# EAGLE design LCD Daughterboard v1.0 (EAGLE 7.7.0)
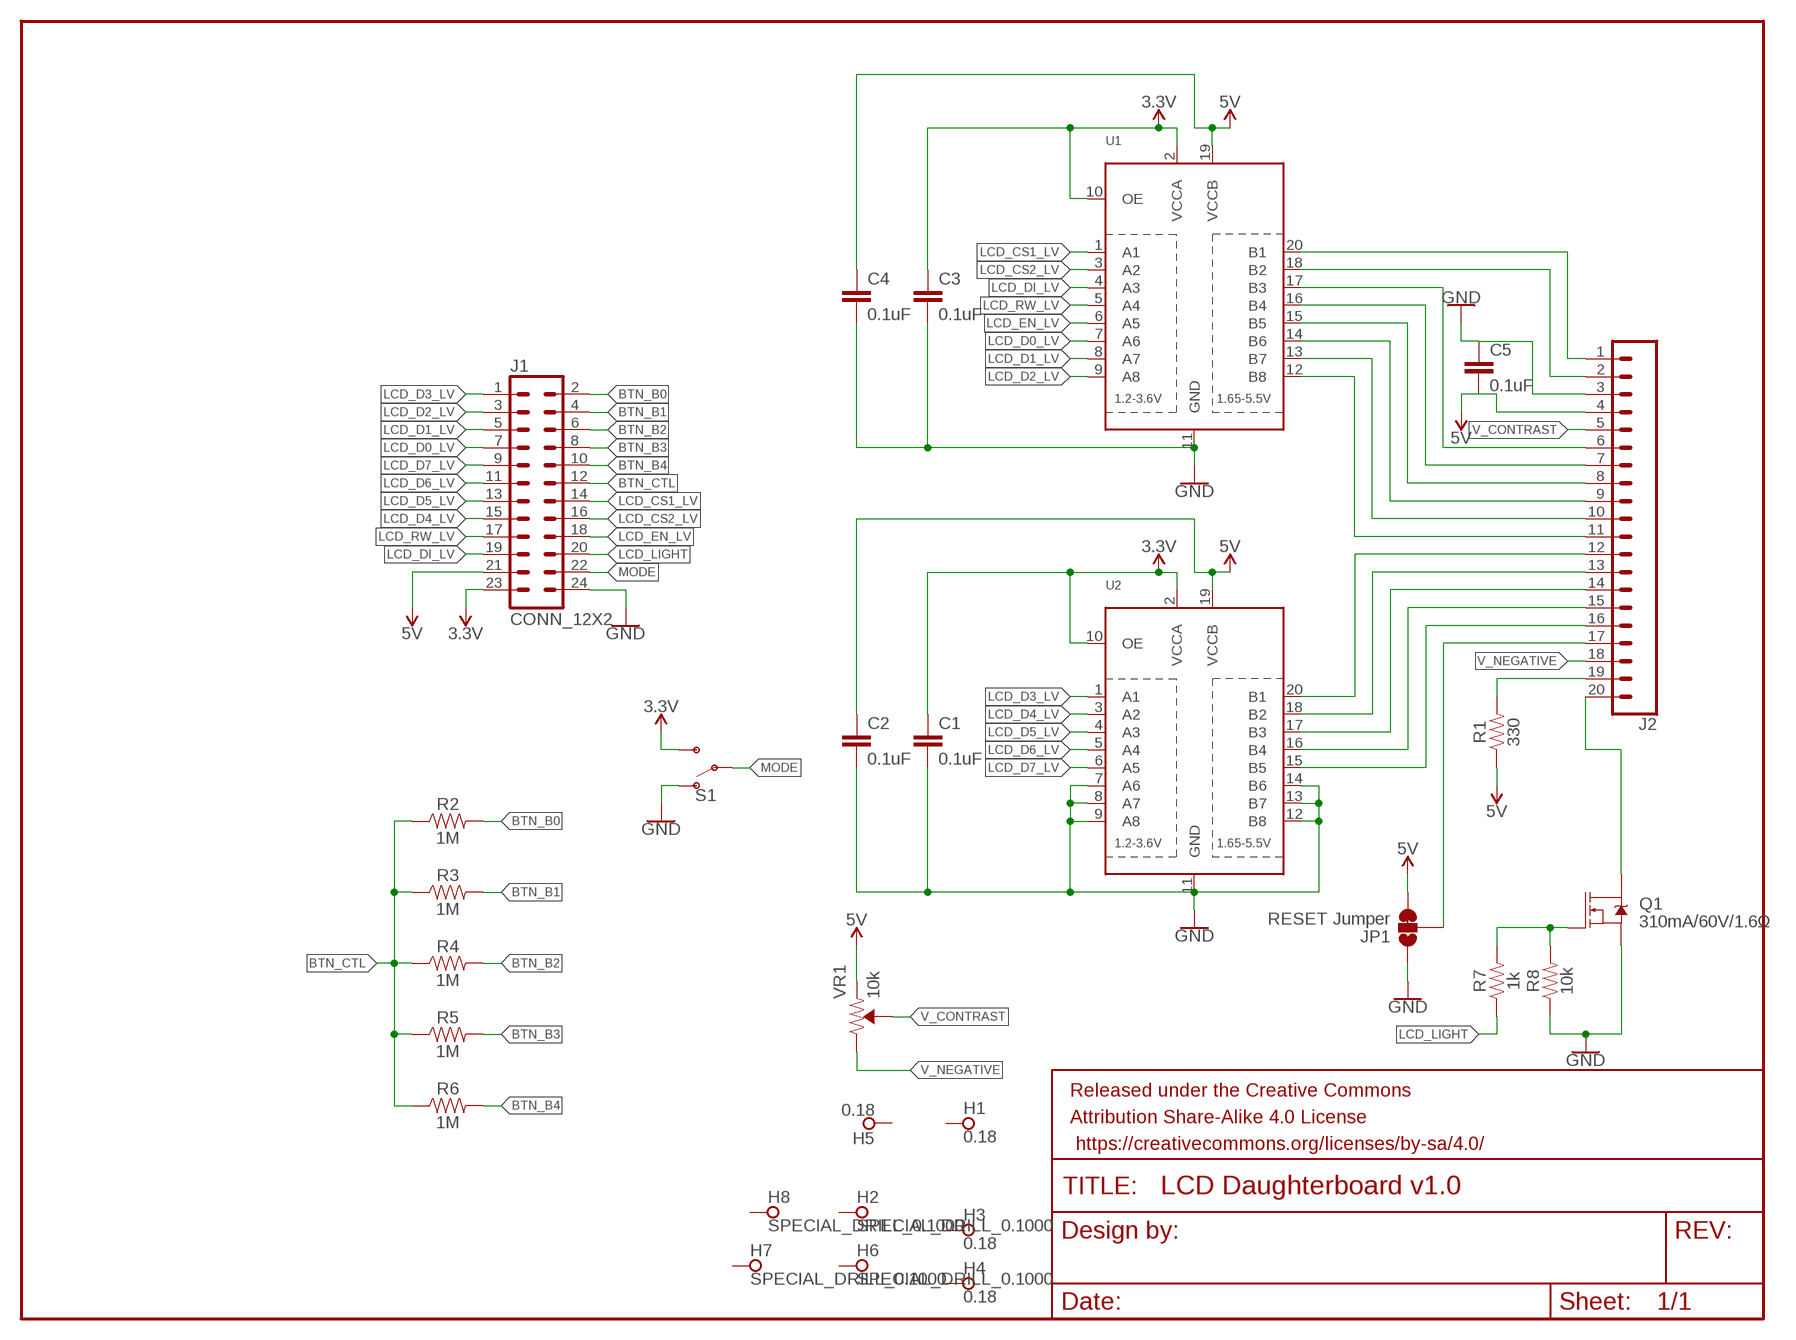
[diagram p0: schematic, sheet 1]

## Parts
C1  0.1uF  0.1UF-0603-25V-(+80/-20%)  [0603]
C2  0.1uF  0.1UF-0603-25V-(+80/-20%)  [0603]
C3  0.1uF  0.1UF-0603-25V-(+80/-20%)  [0603]
C4  0.1uF  0.1UF-0603-25V-(+80/-20%)  [0603]
C5  0.1uF  0.1UF-0603-25V-(+80/-20%)  [0603]
FRAME1  FRAME-LETTERNO_PACKAGE  [DUMMY]
H1  0.18  SPECIAL_DRILL_0.1800  [PAD_0.1800]
H2  SPECIAL_DRILL_0.1000  [PAD_0.1000]
H3  0.18  SPECIAL_DRILL_0.1800  [PAD_0.1800]
H4  0.18  SPECIAL_DRILL_0.1800  [PAD_0.1800]
H5  0.18  SPECIAL_DRILL_0.1800  [PAD_0.1800]
H6  SPECIAL_DRILL_0.1000  [PAD_0.1000]
H7  SPECIAL_DRILL_0.1000  [PAD_0.1000]
H8  SPECIAL_DRILL_0.1000  [PAD_0.1000]
J1  CONN_12X2  [2X12]
J2  CONN_20LOCK  [1X20_LOCK]
JP1  RESET Jumper  JUMPER-SMT_3_1-NC_TRACE_SILK  [SMT-JUMPER_3_1-NC_TRACE_SILK]
Q1  310mA/60V/1.6Ω  MOSFET-NCH-2N7002PW  [SOT323]
R1  330  330OHM-0603-1/10W-1%  [0603]
R2  1M  1MOHM-0603-1/4W-5%  [0603]
R3  1M  1MOHM-0603-1/4W-5%  [0603]
R4  1M  1MOHM-0603-1/4W-5%  [0603]
R5  1M  1MOHM-0603-1/4W-5%  [0603]
R6  1M  1MOHM-0603-1/4W-5%  [0603]
R7  1k  1KOHM-0603-1/10W-1%  [0603]
R8  10k  10KOHM-0603-1/10W-1%  [0603]
S1  SWITCH-SPDT-PTH-11.6X4.0MM  [SWITCH_SPDT_PTH_11.6X4.0MM]
U1  TXB0108PWR  [TSSOP20]
U2  TXB0108PWR  [TSSOP20]
VR1  10k  TRIMPOT-PTH-10MM-KNOB-1/2W-10%  [TRIMPOT-PTH-3386U]

## Nets
3.3V: C1.1 C3.1 J1.23 S1.3(S) U1.2(VCCA) U1.10(OE) U2.2(VCCA) U2.10(OE)
5V: C2.1 C4.1 C5.2 J1.21 J2.4 JP1.3 R1.1 U1.19(VCCB) U2.19(VCCB) VR1.1(CCW)
BTN_B0: J1.2 R2.2
BTN_B1: J1.4 R3.2
BTN_B2: J1.6 R4.2
BTN_B3: J1.8 R5.2
BTN_B4: J1.10 R6.2
BTN_CTL: J1.12 R2.1 R3.1 R4.1 R5.1 R6.1
GND: C1.2 C2.2 C3.2 C4.2 C5.1 J1.24 J2.3 JP1.1 Q1.2(S) R8.1 S1.1(O) U1.11(GND) U2.7(A6) U2.8(A7) U2.9(A8) U2.11(GND) U2.12(B8) U2.13(B7) U2.14(B6)
LCD_CS1_LV: J1.14 U1.1(A1)
LCD_CS2_LV: J1.16 U1.3(A2)
LCD_D0_LV: J1.7 U1.7(A6)
LCD_D1_LV: J1.5 U1.8(A7)
LCD_D2_LV: J1.3 U1.9(A8)
LCD_D3_LV: J1.1 U2.1(A1)
LCD_D4_LV: J1.15 U2.3(A2)
LCD_D5_LV: J1.13 U2.4(A3)
LCD_D6_LV: J1.11 U2.5(A4)
LCD_D7_LV: J1.9 U2.6(A5)
LCD_DI_LV: J1.19 U1.4(A3)
LCD_EN_LV: J1.18 U1.6(A5)
LCD_LIGHT: J1.20 R7.1
LCD_RW_LV: J1.17 U1.5(A4)
MODE: J1.22 S1.2(P)
N$1: J2.1 U1.20(B1)
N$2: J2.2 U1.18(B2)
N$3: J2.6 U1.17(B3)
N$4: J2.7 U1.16(B4)
N$5: J2.8 U1.15(B5)
N$6: J2.9 U1.14(B6)
N$7: J2.10 U1.13(B7)
N$8: J2.11 U1.12(B8)
N$9: J2.19 R1.2
N$10: J2.20 Q1.3(D)
N$11: J2.12 U2.20(B1)
N$12: J2.13 U2.18(B2)
N$13: J2.14 U2.17(B3)
N$14: J2.15 U2.16(B4)
N$15: J2.16 U2.15(B5)
N$16: J2.17 JP1.2
N$17: Q1.1(G) R7.2 R8.2
V_CONTRAST: J2.5 VR1.2(WIPER)
V_NEGATIVE: J2.18 VR1.3(CW)
Unconnected: H1.1 H2.1 H3.1 H4.1 H5.1 H6.1 H7.1 H8.1

## Library data of the parts
C1-C5 = SparkFun-Capacitors:0.1UF: 0.1µF ceramic capacitors A capacitor is a passive two-terminal electrical component used to store electrical energy temporarily in an electric field.; PROD_ID: CAP-00810
FRAME1 = SparkFun-Aesthetics:FRAME-LETTER: Schematic Frame - Letter Standard 8.5x11 US Letter frame; DESIGNER: Nobody; VERSION: v01
H1-H8 = special-drill:SPECIAL_DRILL_: Special drills
J1 = SparkFun-Connectors:CONN_12X2: Multi connection point. Often used as Generic Header-pin footprint for 0.1 inch spaced/style header connections On any of the 0.1 inch spaced packages, you can populate with these: Break Away Headers - Straight <https://www.sparkfun.com/products/116> (PRT-00116) Break Away Male Headers - Right Angle <https://www.sparkfun.com/products/553> (PRT-00553) Female Headers <https://www.sparkfun.com/products/115> (PRT-00115) Break Away Headers - Machine Pin <https://www.sparkfun.com/products/117> (PRT-00117) Break Away Female Headers - Swiss Machine Pin <https://www.sparkfun.com/products/743> (PRT-00743)
J2 = SparkFun-Connectors:CONN_20: Multi connection point. Often used as Generic Header-pin footprint for 0.1 inch spaced/style header connections On any of the 0.1 inch spaced packages, you can populate with these: Break Away Headers - Straight <https://www.sparkfun.com/products/116> (PRT-00116) Break Away Male Headers - Right Angle <https://www.sparkfun.com/products/553> (PRT-00553) Female Headers <https://www.sparkfun.com/products/115> (PRT-00115) Break Away Headers - Machine Pin <https://www.sparkfun.com/products/117> (PRT-00117) Break Away Female Headers - Swiss Machine Pin <https://www.sparkfun.com/products/743> (PRT-00743) For SCREWTERMINALS and SPRING TERMINALS visit here: Screw Terimnals on SparkFun.com <https://www.sparkfun.com/search/results?term=Screw+Terminals> (5mm/3.5mm/2.54mm spacing) This device is also useful as a general connection point to wire up your design to another part of your project. Our various solder wires solder well into these plated through hole pads. Hook-Up Wire - Assortment (Stranded, 22 AWG) <https://www.sparkfun.com/products/11375> (PRT-11375) Hook-Up Wire - Assortment (Solid Core, 22 AWG) <https://www.sparkfun.com/products/11367> (PRT-11367) View the entire wire category on our website here <https://www.sparkfun.com/categories/141> Special notes: Molex polarized connector foot print use with SKU : PRT-08231 with associated crimp pins and housings. 1MM SMD Version SKU: PRT-10208 NOTES ON THE VARIANTS LOCK and LOCK_LONGPADS... This footprint was designed to help hold the alignment of a through-hole component (i.e. 6-pin header) while soldering it into place. You may notice that each hole has been shifted either up or down by 0.005 of an inch from it's more standard position (which is a perfectly straight line). This slight alteration caused the pins (the squares in the middle) to touch the edges of the holes. Because they are alternating, it causes a "brace" to hold the component in place. 0.005 has proven to be the perfect amount of "off-center" position when using our standard breakaway headers. Although looks a little odd when you look at the bare footprint, once you have a header in there, the alteration is very hard to notice. Also,if you push a header all the way into place, it is covered up entirely on the bottom side. Note about LOCK SPECIAL package: This is just like the LOCK variant in that the holes are staggared by 5 mil, but except for the last two holes. They are not altered from the "standard" footprint layout. This is used for a special purpose on the layout of our Graphic LCD Backpack. Make sure you want to use this device before selecting it for you project!
JP1 = SparkFun-Jumpers:JUMPER-SMT_3_1-NC_TRACE: Normally closed trace jumper (1 of 2 connections) This jumper has a trace between two pads so it's normally closed (NC). The other connection is normally open (NO). Use a razor knife to open the connection. For best results follow the IPC guidelines for cutting traces: Cutout at least 0.063 mm (0.005 in). Remove all loose material to clean up the cut area. Seal the cut with an approved epoxy. Reapply solder to reclose the connection, or to close the NO connection.
Q1 = SparkFun-DiscreteSemi:MOSFET-NCH: N-channel MOSFETs Voltage controlled devices that allow control of high current outputs. SparkFun Products: SparkFun OpenScale <https://www.sparkfun.com/products/13261> SparkFun Digital Sandbox <https://www.sparkfun.com/products/12651> SparkFun Monster Moto Shield <https://www.sparkfun.com/products/10182> SparkFun MOSFET Power Controller <https://www.sparkfun.com/products/11214>; PROD_ID: TRANS-11151
R1 = SparkFun-Resistors:330OHM: 330Ω resistor A resistor is a passive two-terminal electrical component that implements electrical resistance as a circuit element. Resistors act to reduce current flow, and, at the same time, act to lower voltage levels within circuits. - Wikipedia; PROD_ID: RES-00818
R2-R6 = SparkFun-Resistors:1MOHM: 1MΩ resistor A resistor is a passive two-terminal electrical component that implements electrical resistance as a circuit element. Resistors act to reduce current flow, and, at the same time, act to lower voltage levels within circuits. - Wikipedia; PROD_ID: RES-07868
R7 = SparkFun-Resistors:1KOHM: 1kΩ resistor A resistor is a passive two-terminal electrical component that implements electrical resistance as a circuit element. Resistors act to reduce current flow, and, at the same time, act to lower voltage levels within circuits. - Wikipedia; PROD_ID: RES-07856
R8 = SparkFun-Resistors:10KOHM: 10kΩ resistor A resistor is a passive two-terminal electrical component that implements electrical resistance as a circuit element. Resistors act to reduce current flow, and, at the same time, act to lower voltage levels within circuits. - Wikipedia; PROD_ID: RES-00824
S1 = SparkFun-Switches:SWITCH-SPDT: Single Pole, Double Throw (SPDT) Switch Single-pole, double-throw (SPDT) switch. Variant Overview SMD-AYZ0202 Surface Mount DPDT Switch <https://www.sparkfun.com/products/597> (COM-00597) Used on e.g. LilyPad Arduino USB - ATmega32U4 Board <https://www.sparkfun.com/products/12049> PTH-11.6X4.0MM SPDT Mini Power Switch <https://www.sparkfun.com/products/102> (COM-00102) Used on e.g. SparkFun Simon Says - Through-Hole Soldering Kit <https://www.sparkfun.com/products/10547> (KIT-10547) PTH-11.6X4.0MM-KIT KIT version of SPDT Mini Power Switch - Simplifies soldering by removing tStop of switch pins - only one side can be soldered. PTH-11.6X4.0MM-LOCK LOCK version of SPDT Mini Power Switch - Offset pins hold switch in place for easier soldering. SMD-RIGHT-ANGLE Surface Mount Right Angle Switch <https://www.sparkfun.com/products/10860> (COM-10860) Used on e.g. SparkFun ESP8266 Thing <https://www.sparkfun.com/products/13231>; PROD_ID: SWCH-08261; SF_SKU: COM-00102
U1 U2 = adafruit:TXB0108PWR: 8-Bit Bi-Directional Level Shifter 1.2V-3.6V (VCCA) to 1.65V-5.5V (VCCB) bi-directional level shifter with auto direction sensing. Max data rate - VCCA 1.8V: 20Mbps (50ns), VCCA 3.3V: 100Mbps (10ns) Digikey: 296-21527-1-ND
VR1 = SparkFun-Resistors:TRIMPOT: Trimming Potentiometer (Trimpot) Three-terminal potentiometers, with an adjustable wiper and two adjustable resistors. A pot can be used to create a configurable voltage divider, or as a variable resistor. "Trimpots" are a subset of potentiometers, usually intended for "set-and-forget" applications. They're often more delicate than standard potentiometers - rated for fewer turns. Variants PTH-KNOB - PTH Trimpot w/ finger-adjustable knob Trimpot 10K with Knob <https://www.sparkfun.com/products/9806> (COM-09806) Datasheet <http://www.sparkfun.com/datasheets/Components/General/TSR-3386.pdf> SMD-3MM-CLOSED-FRAME - SMD 3mm Square Closed-Frame Trimpot Used on e.g. EasyDriver - Stepper Motor Driver <https://www.sparkfun.com/products/12779> Datasheet <http://www.bitechnologies.com/pdfs/22.pdf> (22AR10KTR) SMD-5MM - SMD 5mm Square Closed-Frame Trimpot Used on e.g. IOIO-OTG - V2.2 <https://www.sparkfun.com/products/13613> Datasheet <http://www.vishay.com/docs/51008/ts53.pdf> (TS53YL502MR10) SMD-3MM-1/10W-25% - 3mm Square Open-Frame Trimpot Used on e.g. SparkFun Shapeoko <https://www.sparkfun.com/products/13899> Datasheet <http://www.bourns.com/docs/Product-Datasheets/TC33.pdf> (TC33X-2-103E); PROD_ID: RES-09730; SF_SKU: COM-09806

## Board
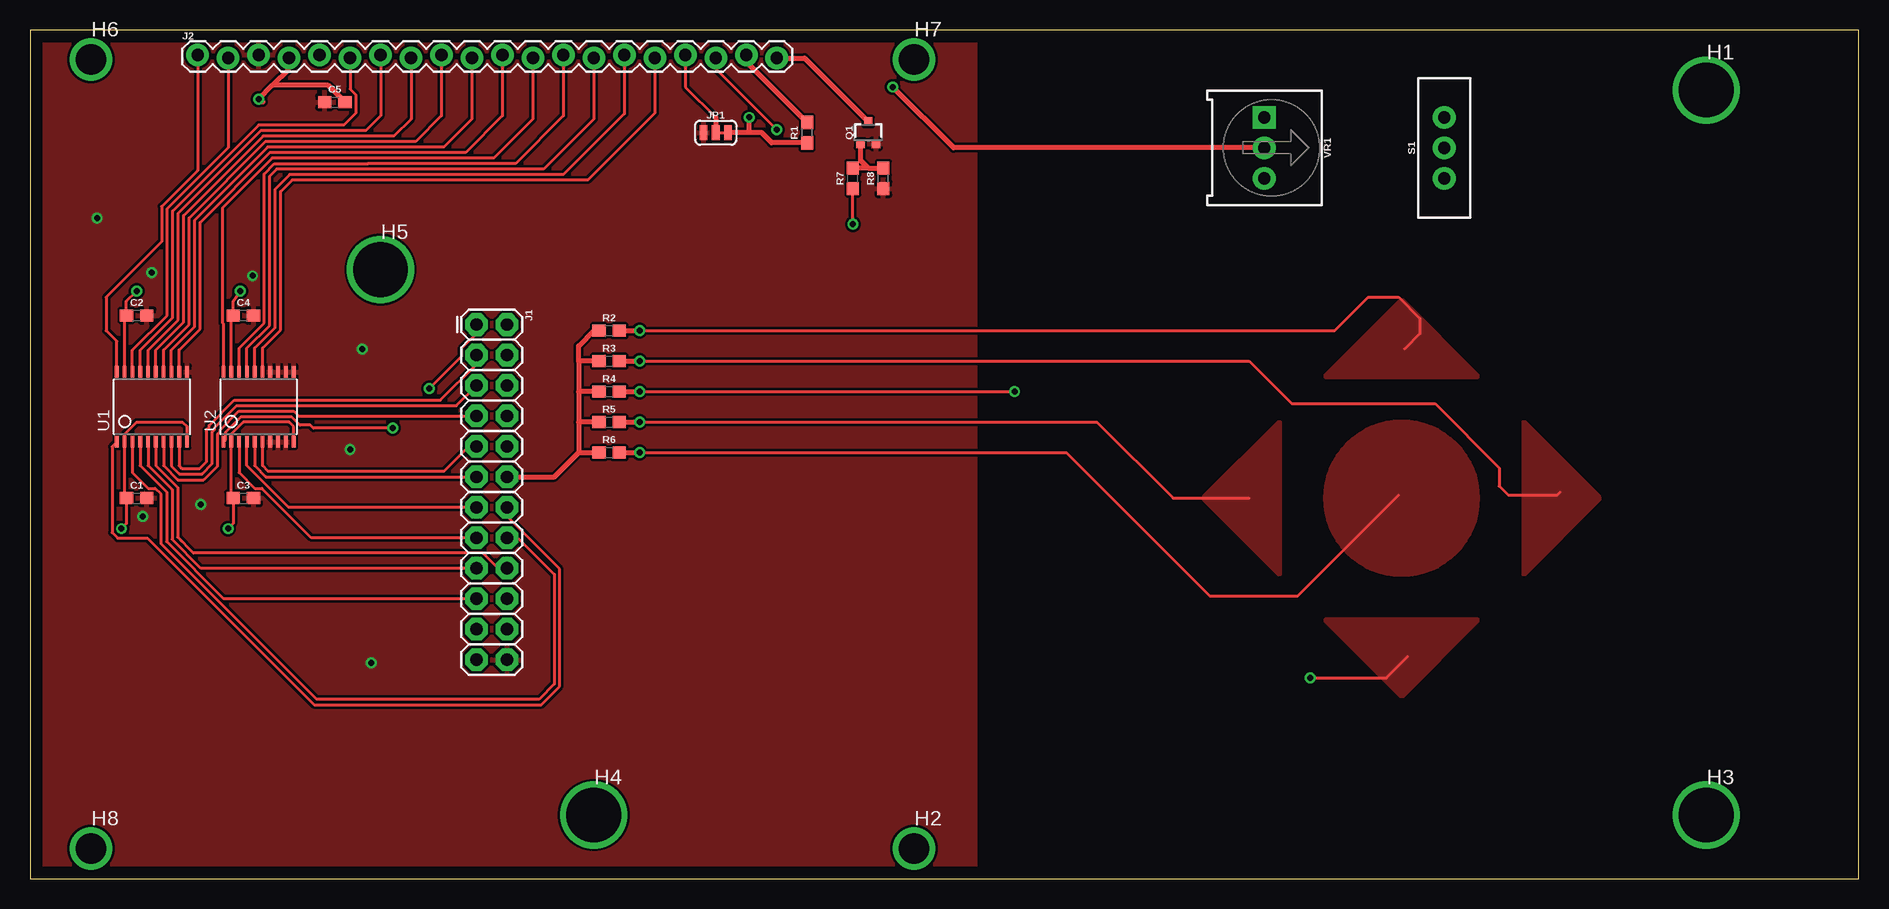
[diagram p1: board, top side]
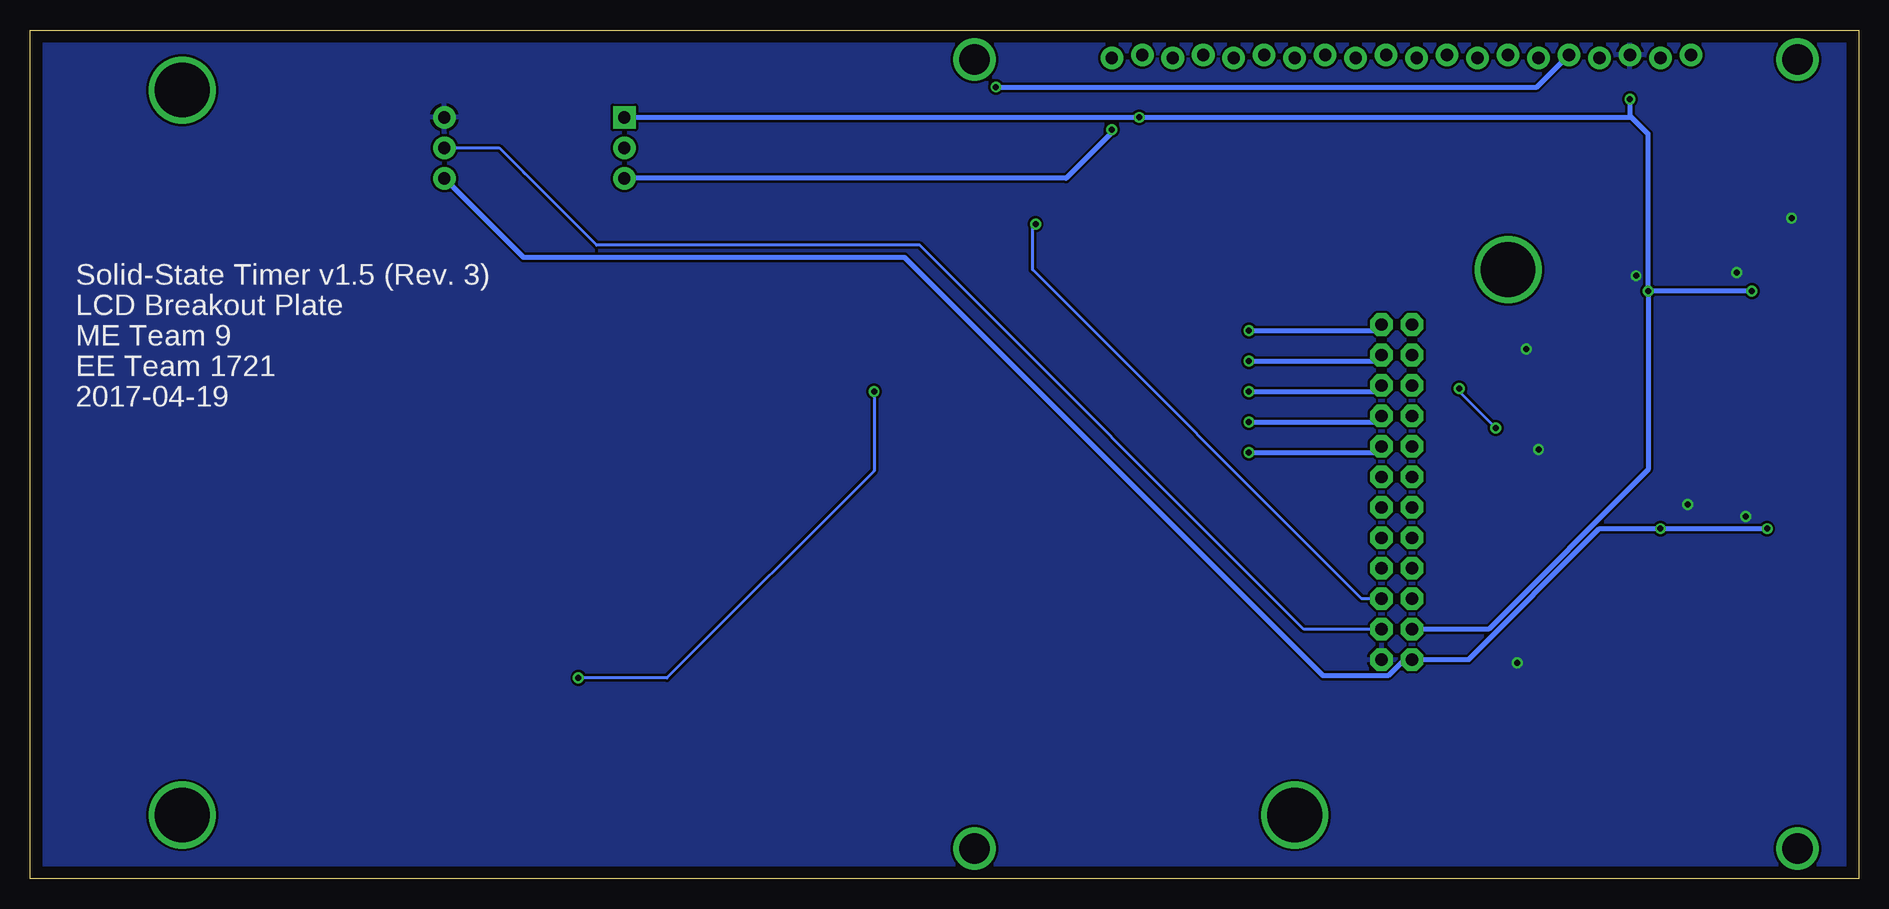
[diagram p2: board, bottom side, seen from below]

Size 152.38 x 70.79 mm. Coordinates in mm from the lower left corner, seen from the top.
Outline: 0,0 152.38,0 152.38,70.79 0,70.79 0,0
Copper layers (1*16): Top 0.035mm / dielectric 1.5mm / Bottom 0.035mm
Design rules "default *": minimum track width 10mil, minimum drill 19mil, track to track 8mil, track to pad 8mil, pad to pad 8mil, via to via 8mil, smd to smd 8mil, copper to edge 40mil, drill to drill 8mil, minimum pad ring 10mil, minimum via ring 8mil, stop-mask expansion 4mil, vias tented up to drill 0mil, thermal gap 10mil

### Footprints (pad centres in the part's own frame; a part is rotated, then mirrored left to right if it is on the bottom)
0603 = smd 1.1 x 1: 1 -0.85,0; 2 0.85,0
PAD_0.1800 = drill 4.572 pad 4.572: 1 0,0
PAD_0.1000 = drill 2.54 pad 2.54: 1 0,0
2X12 = drill 1.016 pad 1.88 octagon: 1 0,0; 2 0,2.54; 3 2.54,0; 4 2.54,2.54; 5 5.08,0; 6 5.08,2.54; 7 7.62,0; 8 7.62,2.54; 9 10.16,0; 10 10.16,2.54; 11 12.7,0; 12 12.7,2.54; 13 15.24,0; 14 15.24,2.54; 15 17.78,0; 16 17.78,2.54; 17 20.32,0; 18 20.32,2.54; 19 22.86,0; 20 22.86,2.54; 21 25.4,0; 22 25.4,2.54; 23 27.94,0; 24 27.94,2.54
1X20_LOCK = drill 1.016 pad 1.88: 1 0,0.127; 2 2.54,-0.127; 3 5.08,0.127; 4 7.62,-0.127; 5 10.16,0.127; 6 12.7,-0.127; 7 15.24,0.127; 8 17.78,-0.127; 9 20.32,0.127; 10 22.86,-0.127; 11 25.4,0.127; 12 27.94,-0.127; 13 30.48,0.127; 14 33.02,-0.127; 15 35.56,0.127; 16 38.1,-0.127; 17 40.64,0.127; 18 43.18,-0.127; 19 45.72,0.127; 20 48.26,-0.127
SMT-JUMPER_3_1-NC_TRACE_SILK = smd 0.635 x 1.27: 1 -1.016,0; 2 0,0; 3 1.016,0
SOT323 = smd 0.7 x 0.7: 1 -0.65,-0.925; 2 0.65,-0.925; 3 0,0.925
SWITCH_SPDT_PTH_11.6X4.0MM = drill 1.016 pad 1.88: 1 0,2.54; 2 0,0; 3 0,-2.54
TSSOP20 = smd 0.305 x 0.991: 1 -2.925,-2.918; 2 -2.275,-2.918; 3 -1.625,-2.918; 4 -0.975,-2.918; 5 -0.325,-2.918; 6 0.325,-2.918; 7 0.975,-2.918; 8 1.625,-2.918; 9 2.275,-2.918; 10 2.925,-2.918; 11 2.925,2.918; 12 2.275,2.918; 13 1.625,2.918; 14 0.975,2.918; 15 0.325,2.918; 16 -0.325,2.918; 17 -0.975,2.918; 18 -1.625,2.918; 19 -2.275,2.918; 20 -2.925,2.918
TRIMPOT-PTH-3386U = drill 1.016 pad 1.88 square: 1 -2.54,-0.015 | drill 1.016 pad 1.88: 2 0,-0.015; 3 2.54,-0.015

### Placement (x,y rotation side)
C1  8.89,31.75 0 top
C2  8.89,46.99 0 top
C3  17.78,31.75 0 top
C4  17.78,46.99 0 top
C5  25.4,64.77 0 top
FRAME1  0,-59.69 0 top  (outside the outline)
H1  139.7,65.79 0 top
H2  73.66,2.54 0 top
H3  139.7,5.33 0 top
H4  46.99,5.33 0 top
H5  29.21,50.8 0 top
H6  5.08,68.33 0 top
H7  73.66,68.33 0 top
H8  5.08,2.54 0 top
J1  37.21,46.23 270 top
J2  13.97,68.58 0 top
JP1  57.15,62.23 0 top
Q1  69.85,62.23 0 top
R1  64.77,62.23 90 top
R2  48.26,45.72 0 top
R3  48.26,43.18 0 top
R4  48.26,40.64 0 top
R5  48.26,38.1 0 top
R6  48.26,35.56 0 top
R7  68.58,58.42 90 top
R8  71.12,58.42 90 top
S1  117.86,60.96 0 top
U1  10.16,39.37 0 top
U2  19.05,39.37 0 top
VR1  102.87,60.96 270 top

### Tracks (layer width: path | path; a pad name or v marks a point on that pad's centre or on a via)
3.3V  (via drill 0.5)
  Top 0.254: U2.10 21.98,37.72 21.59,38.1 17.78,38.1 16.77,37.09 U2.2 16.77,31.91 C3.1 16.93,29.63 v16.51,29.21 | U1.10 13.09,37.72 12.7,38.1 8.89,38.1 7.88,37.09 U1.2 7.88,31.91 C1.1 8.04,29.63 v7.62,29.21
  Bottom 0.406: v7.62,29.21 v16.51,29.21 21.59,29.21 32.51,18.29 J1.23 37.85,18.29 39.19,16.94 44.63,16.94 79.5,51.82 111.25,51.82 S1.3
5V  (via drill 0.5)
  Top 0.254: U2.19 16.77,46.84 C4.1 16.93,48.17 v17.53,49.02 | U1.19 7.88,46.84 C2.1 8.04,48.17 v8.89,49.02
  Top 0.406: 59.94,62.23 60.96,62.23 61.81,61.38 R1.1 | 59.94,62.23 JP1.3 | 59.94,62.23 v59.94,63.5 | 19.41,64.77 arc-45 19.23,64.84 v19.05,65.02 20.19,66.17 | 20.19,66.17 21.59,67.56 J2.4 | C5.2 24.85,66.17 20.19,66.17
  Bottom 0.406: v8.89,49.02 v17.53,49.02 | J1.21 30.83,20.83 17.53,34.14 v17.53,49.02 | VR1.1 v59.94,63.5 18.92,63.5 | v17.53,49.02 17.53,62.1 18.61,63.18 18.92,63.5 | v19.05,65.02 19.05,63.63 18.92,63.5
BTN_B0  (via drill 0.5)
  Top 0.254: v50.8,45.72 108.71,45.72 111.51,48.51 114.05,48.51 115.82,46.74 115.82,45.47 114.55,44.2
  Top 0.406: R2.2 v50.8,45.72
  Bottom 0.406: v50.8,45.72 40.26,45.72 J1.2
  pour Top: 107.95,41.91 120.65,41.91 114.3,48.26
BTN_B1  (via drill 0.5)
  Top 0.254: v50.8,43.18 101.6,43.18 105.16,39.62 117.09,39.62 122.43,34.29 122.43,32.77 123.19,32 127.25,32 127.51,32.26
  Top 0.406: R3.2 v50.8,43.18
  Bottom 0.406: v50.8,43.18 40.26,43.18 J1.4
  pour Top: 124.46,38.1 124.46,25.4 130.81,31.75
BTN_B2  (via drill 0.5)
  Top 0.254: v50.8,40.64 v82.04,40.64 | v106.68,16.76 113.03,16.76 114.81,18.54
  Top 0.406: R4.2 v50.8,40.64
  Bottom 0.254: v82.04,40.64 82.04,34.04 99.31,16.76 v106.68,16.76
  Bottom 0.406: v50.8,40.64 40.26,40.64 J1.6
  pour Top: 120.65,21.59 107.95,21.59 114.3,15.24
BTN_B3  (via drill 0.5)
  Top 0.254: v50.8,38.1 88.9,38.1 95.25,31.75 101.6,31.75
  Top 0.406: R5.2 v50.8,38.1
  Bottom 0.406: v50.8,38.1 40.26,38.1 J1.8
  pour Top: 104.14,25.4 104.14,38.1 97.79,31.75
BTN_B4  (via drill 0.5)
  Top 0.254: v50.8,35.56 86.36,35.56 98.3,23.62 105.66,23.62 114.05,32
  Top 0.406: R6.2 v50.8,35.56
  Bottom 0.406: v50.8,35.56 40.26,35.56 J1.10
  pour Top: 114.3,25.4 arc180 114.3,38.1 arc180
BTN_CTL
  Top 0.406: 45.72,35.56 R6.1 | R2.1 46.99,45.72 45.72,44.45 45.72,43.18 | 45.72,40.64 45.72,38.1 | 45.72,43.18 45.72,40.64 | 45.72,38.1 45.72,35.56 | R5.1 45.72,38.1 | R4.1 45.72,40.64 | R3.1 45.72,43.18 | J1.12 43.69,33.53 45.72,35.56
GND  (via drill 0.5)
  other vias: 28.45,18.03 27.69,44.2 5.59,55.12 10.16,50.55 18.54,50.29 9.4,30.23 14.22,31.24 26.67,35.81
  pour Bottom: 0,70.87 152.4,70.87 152.4,0 0,0
  pour Top: 0,70.87 78.74,70.87 78.74,0 0,0
LCD_CS1_LV
  Top 0.254: U1.1 6.84,36.05 6.84,28.89 7.29,28.43 9.79,28.43 23.69,14.53 42.61,14.53 44.15,16.07 44.15,25.85 39.75,30.24 J1.14
LCD_CS2_LV
  Top 0.254: J1.16 40.64,28.45 43.69,25.4 43.69,16.26 42.42,14.99 23.88,14.99 10.92,27.94 10.92,32.09 10.43,32.58 9.84,32.58 8.54,33.88 U1.3
LCD_D0_LV
  Top 0.254: U1.7 11.13,34.46 12.32,33.27 14.48,33.27 15.64,34.44 15.64,37.08 15.84,37.28 15.84,37.45 17.4,39.01 21.97,39.01 22.38,38.61 J1.7
LCD_D1_LV
  Top 0.254: U1.8 11.79,34.45 12.45,33.79 14.35,33.79 15.19,34.63 15.19,37.27 15.38,37.47 15.38,37.64 17.21,39.47 35.53,39.47 J1.5
LCD_D2_LV
  Top 0.254: J1.3 37.21,42.94 34.2,39.93 17.02,39.93 14.92,37.83 14.92,37.66 14.73,37.46 14.73,34.82 14.16,34.24 12.65,34.24 12.44,34.47 U1.9
LCD_D3_LV  (via drill 0.5)
  Top 0.254: U2.1 16.29,36.62 16.29,37.26 17.59,38.56 21.78,38.56 22.49,37.85 23.37,37.85 23.62,37.59 v30.23,37.59 | v33.27,40.89 35.94,43.56 35.94,44.21 37.21,45.48 J1.1
  Bottom 0.254: v33.27,40.89 33.27,40.64 v30.23,37.59
LCD_D4_LV
  Top 0.254: J1.15 23.45,28.45 19.32,32.58 18.73,32.58 17.43,33.88 U2.3
LCD_D5_LV
  Top 0.254: U2.4 18.07,34.47 21.56,30.99 J1.13
LCD_D6_LV
  Top 0.254: J1.11 19.66,33.53 18.73,34.47 U2.5
LCD_D7_LV
  Top 0.254: J1.9 36.58,36.07 34.49,33.98 19.85,33.98 19.38,34.46 U2.6
LCD_DI_LV
  Top 0.254: U1.4 9.19,34.47 11.38,32.27 11.38,28.13 16.14,23.37 J1.19
LCD_EN_LV
  Top 0.254: U1.6 10.48,34.46 12.29,32.65 12.29,28.51 | 12.29,28.51 12.65,28.15 | J1.18 39.01,25.91 37.74,27.18 13.62,27.18 12.29,28.51
LCD_LIGHT  (via drill 0.5)
  Top 0.254: v68.58,54.61 R7.1
  Bottom 0.254: J1.20 41.4,23.37 68.83,50.8 68.83,54.36 v68.58,54.61
LCD_RW_LV
  Top 0.254: J1.17 14.25,25.91 11.84,28.32 11.84,32.46 9.84,34.47 U1.5
MODE
  Bottom 0.254: J1.22 46.23,20.83 78.23,52.83 105.16,52.83 111.12,58.8 111.25,58.93 113.28,60.96 S1.2
N$1
  Top 0.254: U1.20 7.24,44.84 6.35,45.72 6.35,48.51 10.97,53.14 10.97,56.07 13.97,59.07 J2.1
N$2
  Top 0.254: U1.18 8.54,44.09 11.43,46.99 11.43,55.88 16.51,60.96 J2.2
N$3
  Top 0.254: U1.17 9.19,44.1 11.89,46.8 11.89,55.69 19.05,62.85 26.15,62.85 27.13,63.83 27.13,65.41 26.67,65.87 J2.6
N$4
  Top 0.254: 12.34,46.99 12.34,46.61 9.84,44.1 U1.16 | 12.34,46.99 | 12.34,46.99 12.34,55.5 19.24,62.4 27.98,62.4 29.21,63.63 J2.7
N$5
  Top 0.254: 12.8,47.18 12.8,46.42 10.48,44.1 U1.15 | 12.8,47.18 | 12.8,47.18 12.8,55.31 19.43,61.94 30.32,61.94 31.75,63.37 J2.8
N$6
  Top 0.254: U1.14 11.13,44.11 13.26,46.23 13.26,47.37 | 13.26,47.37 | 13.26,47.37 13.26,55.12 19.62,61.48 32.15,61.48 34.29,63.63 J2.9
N$7
  Top 0.254: U1.13 11.79,44.11 13.72,46.04 13.72,54.93 19.81,61.02 34.48,61.02 36.83,63.37 J2.10
N$8
  Top 0.254: U1.12 12.44,44.12 14.17,45.85 14.17,54.74 20,60.57 36.31,60.57 39.37,63.63 J2.11
N$9
  Top 0.406: J2.19 59.69,68.16 R1.2
N$10
  Top 0.406: J2.20 64.55,68.45 Q1.3
N$11
  Top 0.254: U2.20 16.12,46.28 16.05,46.35 16.05,55.97 20.19,60.11 38.65,60.11 41.91,63.37 J2.12
N$12
  Top 0.254: U2.18 17.43,44.27 19.51,46.35 19.51,58.79 20.37,59.64 28.15,59.64 28.16,59.65 40.48,59.65 44.45,63.63 J2.13
N$13
  Top 0.254: U2.17 18.07,44.27 19.97,46.16 19.97,58.6 20.56,59.19 42.8,59.19 46.99,63.37 J2.14
N$14
  Top 0.254: U2.16 18.73,44.27 20.43,45.97 20.43,57.51 21.64,58.73 44.45,58.73 49.53,63.81 J2.15
N$15
  Top 0.254: U2.15 19.38,44.28 20.88,45.78 20.88,57.32 21.84,58.27 46.48,58.27 52.07,63.86 J2.16
N$16
  Top 0.254: J2.17 54.61,66.04 57.15,63.5
  Top 0.406: 57.15,63.5 JP1.2
N$17
  Top 0.406: 69.85,59.27 R7.2 | 69.85,59.27 R8.2 | Q1.1 69.2,59.92 69.85,59.27
V_CONTRAST  (via drill 0.5)
  Top 0.406: VR1.2 76.96,60.96 v71.88,66.04
  Bottom 0.406: J2.5 26.8,66.04 v71.88,66.04
V_NEGATIVE  (via drill 0.5)
  Top 0.254: J2.18 57.15,67.56 v62.23,62.48
  Bottom 0.406: VR1.3 66.04,58.42 62.23,62.23 v62.23,62.48

### Text on the board
bPlace: Solid-State Timer v1.5 (Rev. 3) | LCD Breakout Plate | ME Team 9 | EE Team 1721 | 2017-04-19